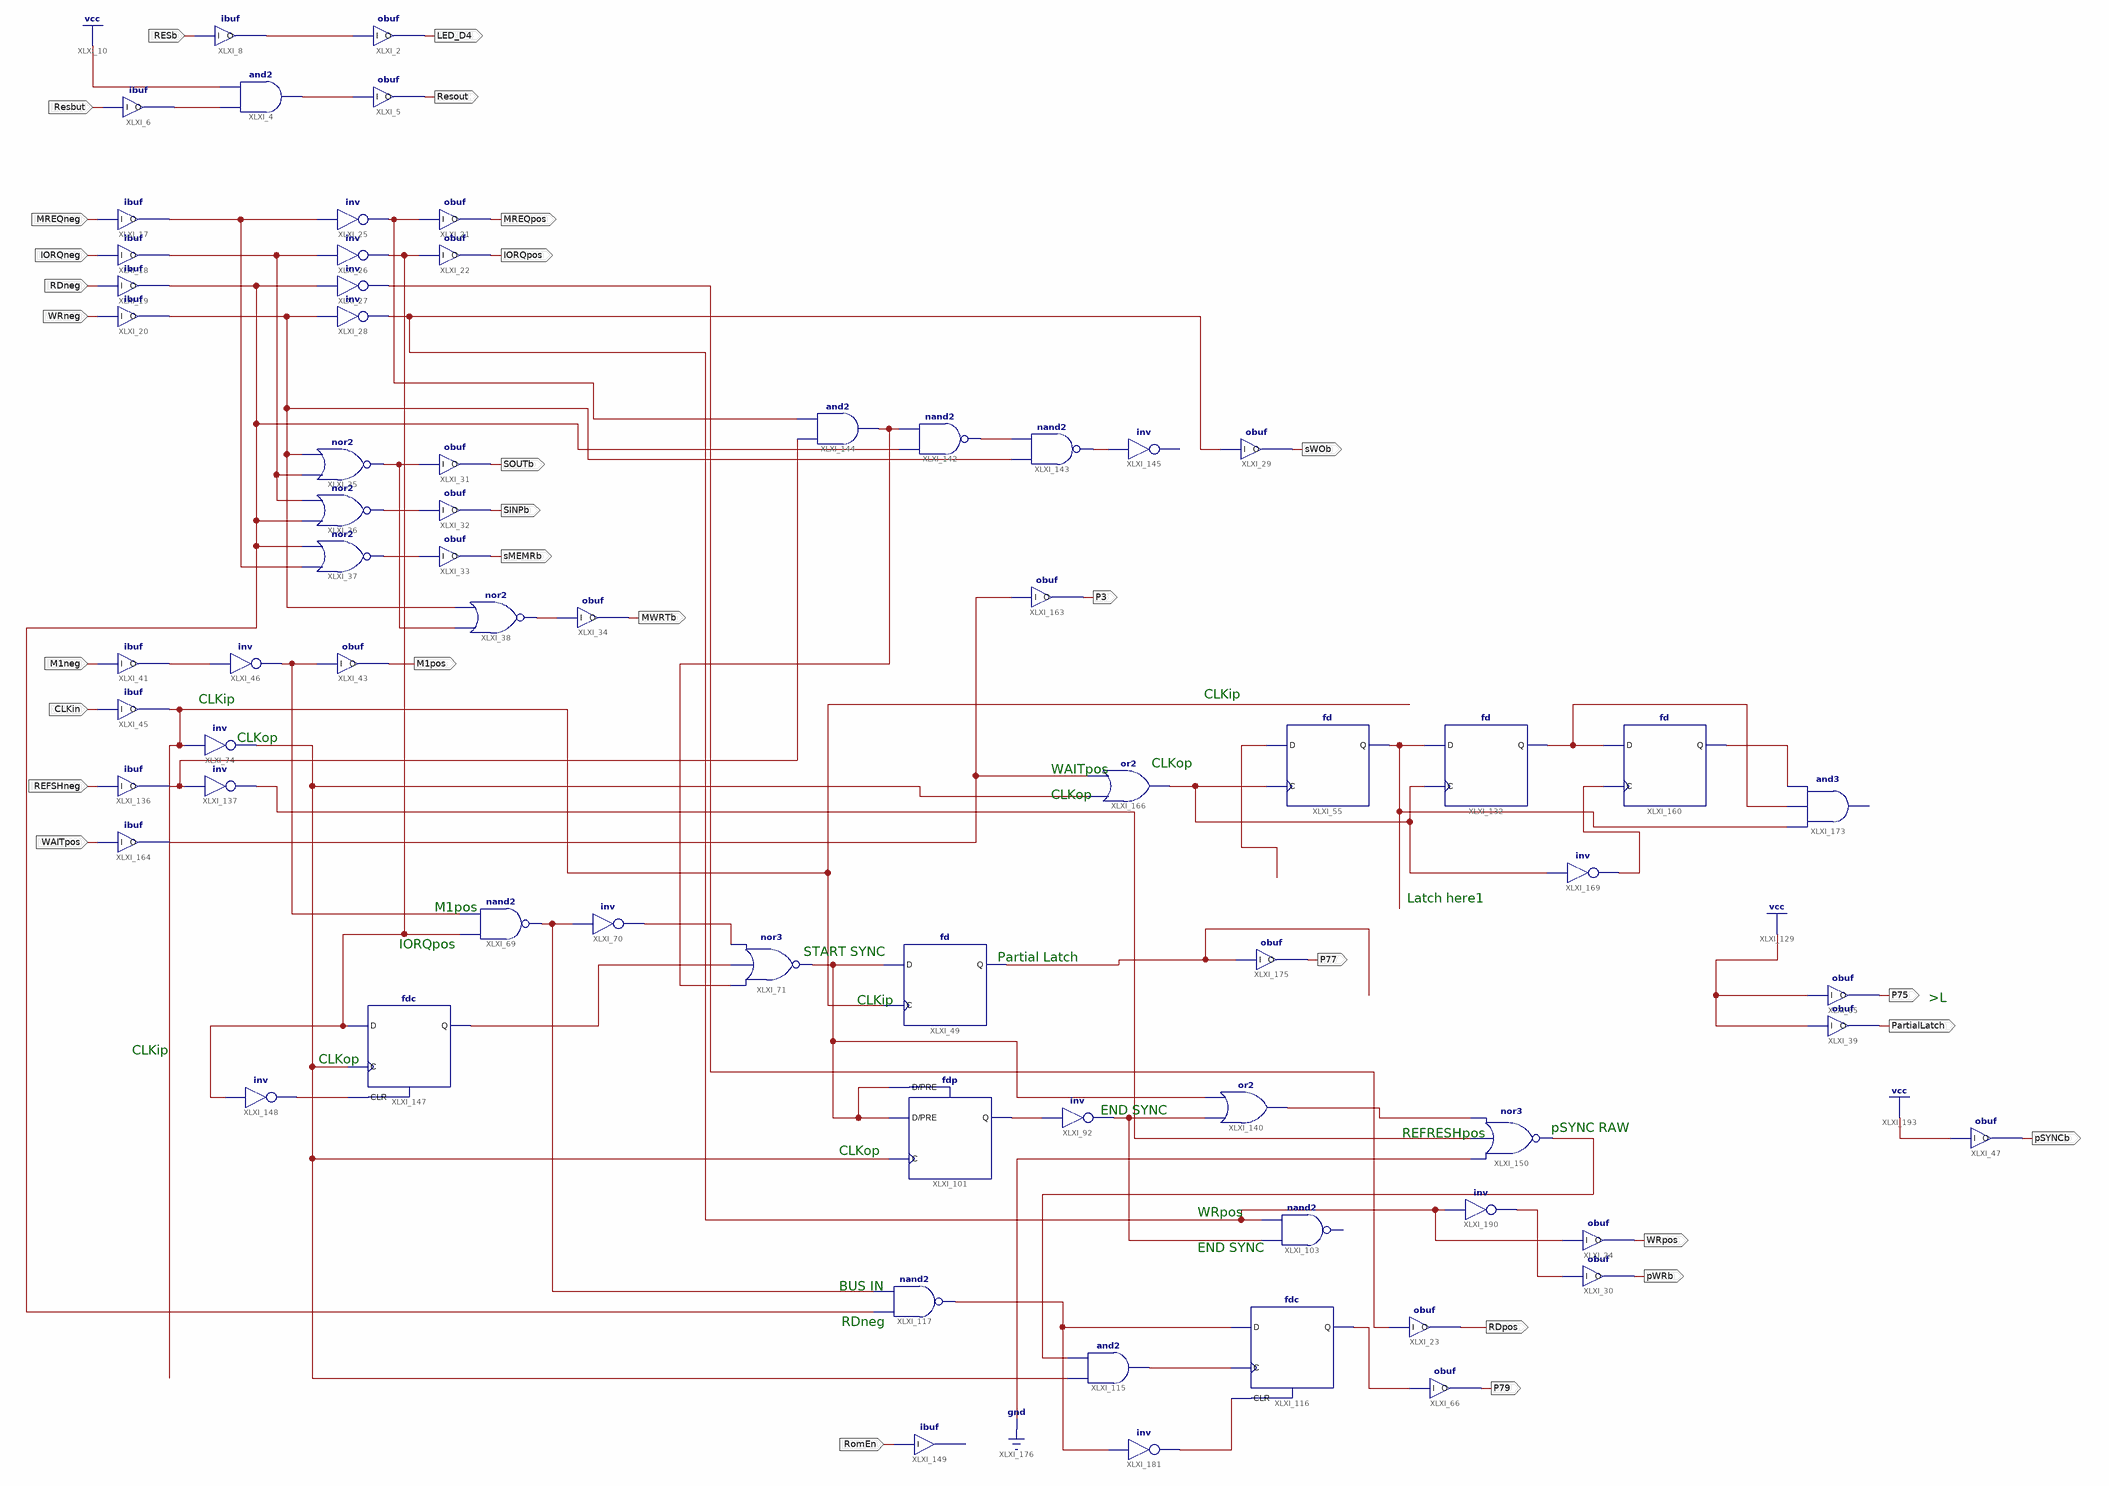
[diagram p0: schematic sheet 1]
// Xilinx ISE schematic IC1v2_4.sch (xc9500) as structural Verilog: 68 symbols, 30 ports
module IC1v2_4 (
  input  Resbut,
  input  RESb,
  input  MREQneg,
  input  IORQneg,
  input  RDneg,
  input  WRneg,
  input  M1neg,
  input  CLKin,
  input  REFSHneg,
  input  WAITpos,
  input  RomEn,
  output Resout,
  output LED_D4,
  output MREQpos,
  output IORQpos,
  output SOUTb,
  output SINPb,
  output sMEMRb,
  output MWRTb,
  output M1pos,
  output RDpos,
  output sWOb,
  output pSYNCb,
  output PartialLatch,
  output P75,
  output P77,
  output P79,
  output pWRb,
  output WRpos,
  output P3
);

  wire XLXN_6, XLXN_10, XLXN_13, XLXN_40, XLXN_44, XLXN_45, XLXN_48, XLXN_54, XLXN_58, XLXN_64, XLXN_67,
       XLXN_75, XLXN_129, XLXN_131, XLXN_134, XLXN_157, XLXN_182, XLXN_183, XLXN_185, XLXN_190, XLXN_226,
       XLXN_230, XLXN_233, XLXN_234, XLXN_239, XLXN_240, XLXN_253, XLXN_269, XLXN_273, XLXN_276, XLXN_279,
       XLXN_280, XLXN_283, XLXN_286, XLXN_290, XLXN_306, XLXN_308, XLXN_323, XLXN_328, XLXN_330, XLXN_331,
       XLXN_340, XLXN_343, XLXN_347, XLXN_350, XLXN_352;

  and XLXI_4 (XLXN_13, XLXN_6, 1'b1);
  obuf XLXI_5 (.I(XLXN_13), .O(Resout));
  ibuf XLXI_6 (.I(Resbut), .O(XLXN_6));
  obuf XLXI_2 (.I(XLXN_10), .O(LED_D4));
  ibuf XLXI_8 (.I(RESb), .O(XLXN_10));
  ibuf XLXI_17 (.I(MREQneg), .O(XLXN_58));
  ibuf XLXI_18 (.I(IORQneg), .O(XLXN_54));
  ibuf XLXI_19 (.I(RDneg), .O(XLXN_276));
  ibuf XLXI_20 (.I(WRneg), .O(XLXN_40));
  obuf XLXI_21 (.I(XLXN_75), .O(MREQpos));
  obuf XLXI_22 (.I(XLXN_240), .O(IORQpos));
  not XLXI_25 (XLXN_75, XLXN_58);
  not XLXI_26 (XLXN_240, XLXN_54);
  not XLXI_27 (XLXN_323, XLXN_276);
  not XLXI_28 (XLXN_352, XLXN_40);
  obuf XLXI_31 (.I(XLXN_48), .O(SOUTb));
  obuf XLXI_32 (.I(XLXN_190), .O(SINPb));
  obuf XLXI_33 (.I(XLXN_45), .O(sMEMRb));
  obuf XLXI_34 (.I(XLXN_44), .O(MWRTb));
  nor XLXI_35 (XLXN_48, XLXN_54, XLXN_40);
  nor XLXI_36 (XLXN_190, XLXN_276, XLXN_54);
  nor XLXI_37 (XLXN_45, XLXN_58, XLXN_276);
  nor XLXI_38 (XLXN_44, XLXN_48, XLXN_40);
  ibuf XLXI_41 (.I(M1neg), .O(XLXN_64));
  obuf XLXI_43 (.I(XLXN_67), .O(M1pos));
  ibuf XLXI_45 (.I(CLKin), .O(XLXN_280));
  not XLXI_46 (XLXN_67, XLXN_64);
  fd XLXI_49 (.C(XLXN_280), .D(XLXN_308), .Q(XLXN_350));
  nand XLXI_69 (XLXN_185, XLXN_240, XLXN_67);
  not XLXI_70 (XLXN_129, XLXN_185);
  nor XLXI_71 (XLXN_308, XLXN_253, XLXN_134, XLXN_129);
  not XLXI_74 (XLXN_131, XLXN_280);
  not XLXI_92 (XLXN_328, XLXN_157);
  // nand2 XLXI_103 has open pins: I0=XLXN_328, I1=XLXN_352, O=open
  fd XLXI_55 (.C(XLXN_283), .D(XLXN_343), .Q(XLXN_286));
  obuf XLXI_23 (.I(XLXN_323), .O(RDpos));
  and XLXI_115 (XLXN_183, XLXN_131, XLXN_340);
  fdc XLXI_116 (.C(XLXN_183), .CLR(XLXN_331), .D(XLXN_182), .Q(XLXN_330));
  nand XLXI_117 (XLXN_182, XLXN_276, XLXN_185);
  fd XLXI_132 (.C(XLXN_283), .D(XLXN_286), .Q(XLXN_273));
  ibuf XLXI_136 (.I(REFSHneg), .O(XLXN_226));
  not XLXI_137 (XLXN_230, XLXN_226);
  or XLXI_140 (XLXN_269, XLXN_328, XLXN_308);
  nand XLXI_142 (XLXN_234, XLXN_276, XLXN_253);
  nand XLXI_143 (XLXN_233, XLXN_40, XLXN_234);
  and XLXI_144 (XLXN_253, XLXN_226, XLXN_75);
  // inv XLXI_145 has open pins: I=XLXN_233, O=open
  obuf XLXI_29 (.I(XLXN_352), .O(sWOb));
  fdc XLXI_147 (.C(XLXN_131), .CLR(XLXN_239), .D(XLXN_240), .Q(XLXN_134));
  not XLXI_148 (XLXN_239, XLXN_240);
  nor XLXI_150 (XLXN_340, 1'b0, XLXN_230, XLXN_269);
  obuf XLXI_47 (.I(1'b1), .O(pSYNCb));
  obuf XLXI_39 (.I(1'b1), .O(PartialLatch));
  fd XLXI_160 (.C(XLXN_290), .D(XLXN_273), .Q(XLXN_306));
  ibuf XLXI_164 (.I(WAITpos), .O(XLXN_279));
  or XLXI_166 (XLXN_283, XLXN_131, XLXN_279);
  not XLXI_169 (XLXN_290, XLXN_283);
  obuf XLXI_65 (.I(1'b1), .O(P75));
  // and3 XLXI_173 has open pins: I0=XLXN_286, I1=XLXN_273, I2=XLXN_306, O=open
  obuf XLXI_175 (.I(XLXN_350), .O(P77));
  ibuf XLXI_149 (.I(RomEn));  // open: O
  not XLXI_181 (XLXN_331, XLXN_182);
  obuf XLXI_66 (.I(XLXN_330), .O(P79));
  fdp XLXI_101 (.C(XLXN_131), .D(XLXN_308), .PRE(XLXN_308), .Q(XLXN_157));
  obuf XLXI_30 (.I(XLXN_347), .O(pWRb));
  not XLXI_190 (XLXN_347, XLXN_352);
  obuf XLXI_24 (.I(XLXN_352), .O(WRpos));
  obuf XLXI_163 (.I(XLXN_279), .O(P3));

  // Notes on the sheet:
  //   CLKip
  //   CLKip
  //   CLKop
  //   CLKop
  //   WAITpos
  //   CLKop
  //   Latch here1
  //   M1pos
  //   IORQpos
  //   START SYNC
  //   Partial Latch
  //   >L
  //   CLKip
  //   CLKip
  //   CLKop
  //   END SYNC
  //   pSYNC RAW
  //   REFRESHpos
  //   CLKop
  //   WRpos
  //   END SYNC
  //   BUS IN
  //   RDneg
endmodule
